# Altium schematic sheet Sheet3.SchDoc
size A; SheetNumber: 3; SheetTotal: 3
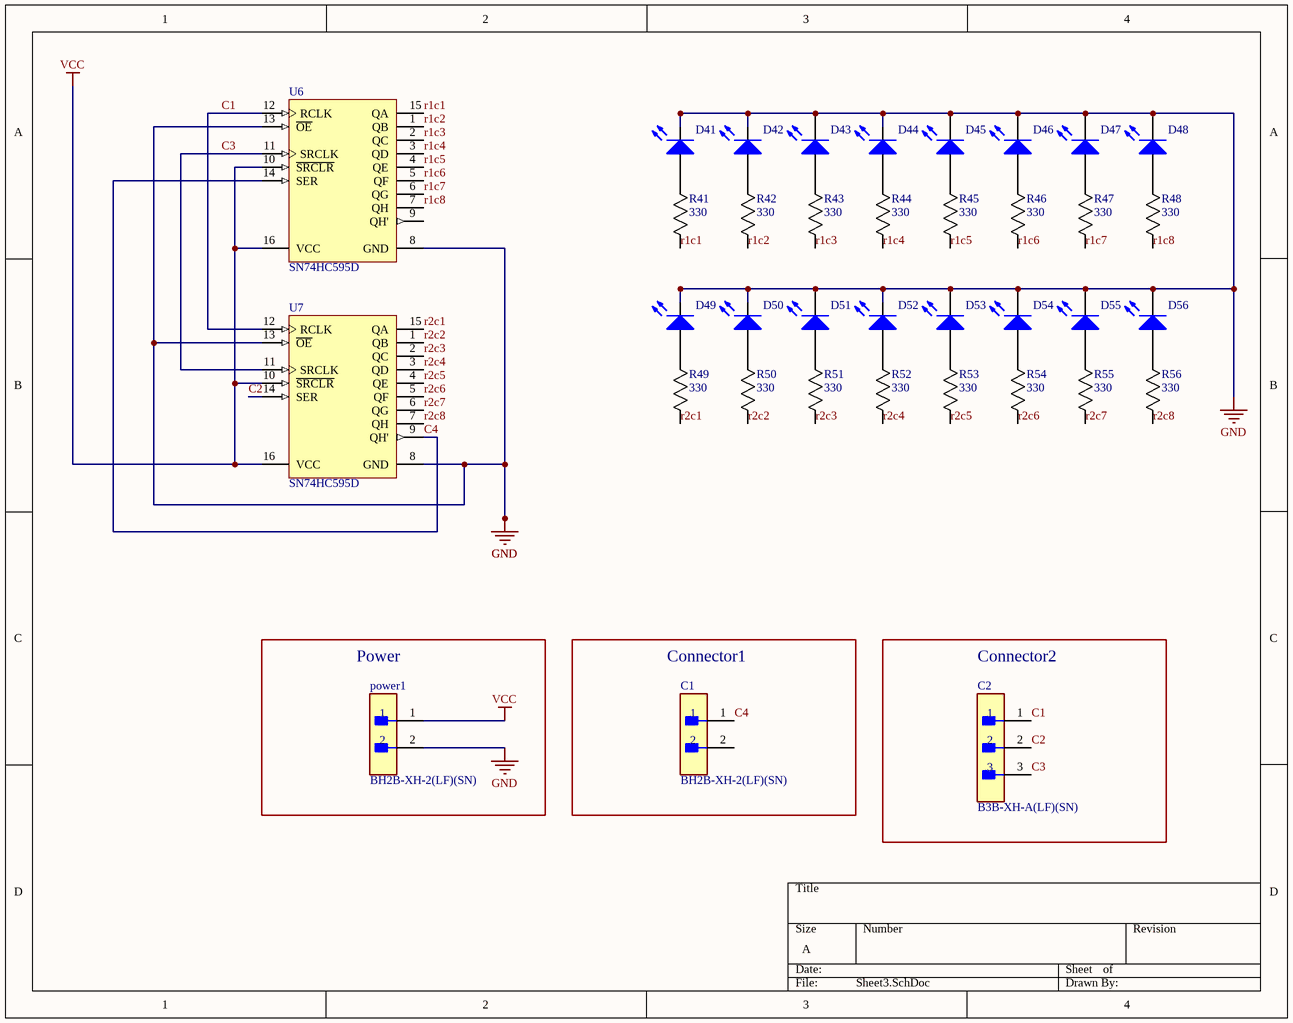
[diagram p0: Sheet3.SchDoc]

## Parts
C1  BH2B-XH-2(LF)(SN)  [FP-BH2B-XH-2_LF_SN-MFG]
C2  B3B-XH-A(LF)(SN)  [FP-B3B-XH-A_LF_SN-MFG]
D41  Light-Emitting Diode  (value not drawn)
D42  Light-Emitting Diode  (value not drawn)
D43  Light-Emitting Diode  (value not drawn)
D44  Light-Emitting Diode  (value not drawn)
D45  Light-Emitting Diode  (value not drawn)
D46  Light-Emitting Diode  (value not drawn)
D47  Light-Emitting Diode  (value not drawn)
D48  Light-Emitting Diode  (value not drawn)
D49  Light-Emitting Diode  (value not drawn)
D50  Light-Emitting Diode  (value not drawn)
D51  Light-Emitting Diode  (value not drawn)
D52  Light-Emitting Diode  (value not drawn)
D53  Light-Emitting Diode  (value not drawn)
D54  Light-Emitting Diode  (value not drawn)
D55  Light-Emitting Diode  (value not drawn)
D56  Light-Emitting Diode  (value not drawn)
power1  BH2B-XH-2(LF)(SN)  [FP-BH2B-XH-2_LF_SN-MFG]
R41  330  [RES_AC03_VIS]
R42  330  [RES_AC03_VIS]
R43  330  [RES_AC03_VIS]
R44  330  [RES_AC03_VIS]
R45  330  [RES_AC03_VIS]
R46  330  [RES_AC03_VIS]
R47  330  [RES_AC03_VIS]
R48  330  [RES_AC03_VIS]
R49  330  [RES_AC03_VIS]
R50  330  [RES_AC03_VIS]
R51  330  [RES_AC03_VIS]
R52  330  [RES_AC03_VIS]
R53  330  [RES_AC03_VIS]
R54  330  [RES_AC03_VIS]
R55  330  [RES_AC03_VIS]
R56  330  [RES_AC03_VIS]
U6  SN74HC595D  [D0016A_L]
U7  SN74HC595D  [D0016A_L]

## Blocks framed on the sheet
Power: power1
Connector1: C1
Connector2: C2

## Nets
GND: D41.2(K) D42.2(K) D43.2(K) D44.2(K) D45.2(K) D46.2(K) D47.2(K) D48.2(K) D49.2(K) D50.2(K) D51.2(K) D52.2(K) D53.2(K) D54.2(K) D55.2(K) D56.2(K) power1.2 U6.8(GND) U6.13(~{OE}) U7.8(GND) U7.13(~{OE})
VCC: power1.1 U6.10(~{SRCLR}) U6.16(VCC) U7.10(~{SRCLR}) U7.16(VCC)
C1: C2.1 U6.12(RCLK) U7.12(RCLK)
C2: C2.2 U7.14(SER)
C3: C2.3 U6.11(SRCLK) U7.11(SRCLK)
C4: C1.1 U6.14(SER) U7.9(QH')
r1c1: R41.1 U6.15(QA)
r1c2: R42.1 U6.1(QB)
r1c3: R43.1 U6.2(QC)
r1c4: R44.1 U6.3(QD)
r1c5: R45.1 U6.4(QE)
r1c6: R46.1 U6.5(QF)
r1c7: R47.1 U6.6(QG)
r1c8: R48.1 U6.7(QH)
r2c1: R49.1 U7.15(QA)
r2c2: R50.1 U7.1(QB)
r2c3: R51.1 U7.2(QC)
r2c4: R52.1 U7.3(QD)
r2c5: R53.1 U7.4(QE)
r2c6: R54.1 U7.5(QF)
r2c7: R55.1 U7.6(QG)
r2c8: R56.1 U7.7(QH)
NetD41_1: D41.1(A) R41.2
NetD42_1: D42.1(A) R42.2
NetD43_1: D43.1(A) R43.2
NetD44_1: D44.1(A) R44.2
NetD45_1: D45.1(A) R45.2
NetD46_1: D46.1(A) R46.2
NetD47_1: D47.1(A) R47.2
NetD48_1: D48.1(A) R48.2
NetD49_1: D49.1(A) R49.2
NetD50_1: D50.1(A) R50.2
NetD51_1: D51.1(A) R51.2
NetD52_1: D52.1(A) R52.2
NetD53_1: D53.1(A) R53.2
NetD54_1: D54.1(A) R54.2
NetD55_1: D55.1(A) R55.2
NetD56_1: D56.1(A) R56.2

Not connected (* = marked no-connect by the designer): C1 2; U6 9(QH')

## Library data of the parts
C1 power1 = CMP-17439-000730-1: CONN HEADER VERT 2POS 2.5MM; Voltage Rating (AC): 250V; Number of Positions: 2; Pitch: 2.5mm; Contact Type: Male Pin; Max Operating Temperature: 85°C; Termination: Press-Fit; Connector Type: Header; Flammability Rating: UL94 V-0; Min Operating Temperature: -25°C; Contact Material: Copper Alloy; Series: XH; Lead Free: Lead Free; Fastening Type: Detent; Contact Finish - Mating: TIN; Number of Rows: 1; Insulation Color: Natural; Insulation Material: Nylon; Mount: Through Hole; Contact Shape: Square
C2 = CMP-17439-000014-3: CONN HEADER VERT 3POS 2.5MM; Max Voltage Rating (DC): 250V; Number of Positions: 3; Current Rating: 3A; Color: Natural; Gender: Male; Wire/Cable Gauge: 22AWG; Contact Resistance: 20mR; Insulation Resistance: 1GR; Insulation Material: Nylon; Contact Plating: Tin; Depth: 5.75mm; Contact Type: Male Pin; Max Operating Temperature: 85°C; Insulation Color: Natural; Voltage Rating (AC): 250V; Connector Type: Header; Orientation: Straight; Fastening Type: Detent; Housing Color: White; Min Operating Temperature: -25°C; Termination: Solder; Voltage Rating: 250V; Series: XH; Pitch: 2.5mm; Contact Shape: Square; Number of Rows: 1; Lead Free: Lead Free; Packaging: Bulk; Mount: Through Hole; Flammability Rating: UL94 V-0; Max Voltage Rating (AC): 250V; REACH SVHC: No SVHC; Housing Material: Polyamide; Contact Material: Brass; Lead Pitch: 2.5mm; Contact Finish - Mating: TIN; Length: 9.9mm; Max Current Rating: 3A; Number of Contacts: 3
D41-D56 = LED: AF: 1; BV: 0; BV_MAX: 1e99; EG: 1.11; FC: 0.5; IBV: 0.001; IS: 1e-14; MJSW: 0.33; NTUN: 30; TNOM: 27; XTI: 3; SimulationGenericComponent: True; CJO: 0; CJP: 0; CTA: 0; CTP: 0; FCS: 0.5; FV_MAX: 1e99; IKF: 0; IKR: 0; ISR: 1e-14; JSW: 0; JTUN: 0; JTUNSW: 0; KEG: 1; KF: 0; LEVEL: 1; N: 1; NBV: 1; NR: 1; NS: 1; PHP: 1; RS: 0; TCV: 0; TLEV: 0; TLEVC: 0; TM1: 0; TM2: 0; TPB: 0; TPHP: 0; TRS: 0; TRS2: 0; TT: 0; TTT1: 0; TTT2: 0; VJ: 1; XTITUN: 3
R41-R56 = CMP-00030-39746358-1: AC03000001000JAC00 VISHAY AC03000001000JAC00 Through Hole Resistor, 100 ohm, Axial Leaded, 3 W, 5%, AC Series; Voltage Rating: 17V; Lead Diameter: 800µm; Temperature Coefficient: -80ppm/°C; Resistance: 100Ω; Max Power Dissipation: 3W; Features: Flame Retardant Coating; Number of Pins: 2; Military Standard: Not; Voltage Rating (DC): 17V; Termination: Axial; Width: 4.8mm; Tolerance: 5%; Diameter: 4.8mm; Schedule B: 8533210080, 8533210080; Contact Plating: Tin; NexarPartId: 39746358; RoHS: Compliant; Composition: Wirewound; Max Operating Temperature: 275°C; Packaging: Cut Tape (CT); Number of Terminations: 2; REACH SVHC: Unknown; Power Rating: 3W; Case/Package: Conformal; Radiation Hardening: No; Min Operating Temperature: 0°C; Length: 13mm
U6 U7 = CMP-0780-00038-3: 8-Bit Shift Registers With 3-State Output Registers, D0016A, TUBE; Manufacturer: Texas Instruments; Bits: 8; F @ Nom Voltage(Max)(Mhz): 28; Voltage(Nom)(V): 6; ICC @ Nom Voltage(Max)(mA): 0.08; Output Drive (IOL/IOH)(Max)(mA): 7.8/-7.8; tpd @ Nom Voltage(Max)(ns): 34; 3-State Output: Yes; VCC(Min)(V): 2; Output Type: CMOS; Technology Family: HC; Rating: Military; Generic Part Number: SN74HC595; PackageReference: D0016A; Code_JEDEC: MS-012 variation AC; Operating Temperature Range(C): -40 to 85; VCC(Max)(V): 6; DatasheetVersion: SCLS041H; Input Type: CMOS; PackageVersion: http://www.ti.com/lit/ml/mpds178g/mpds178g.pdf